# EAGLE design Dashboard buzzer tester (EAGLE 9.6.2)
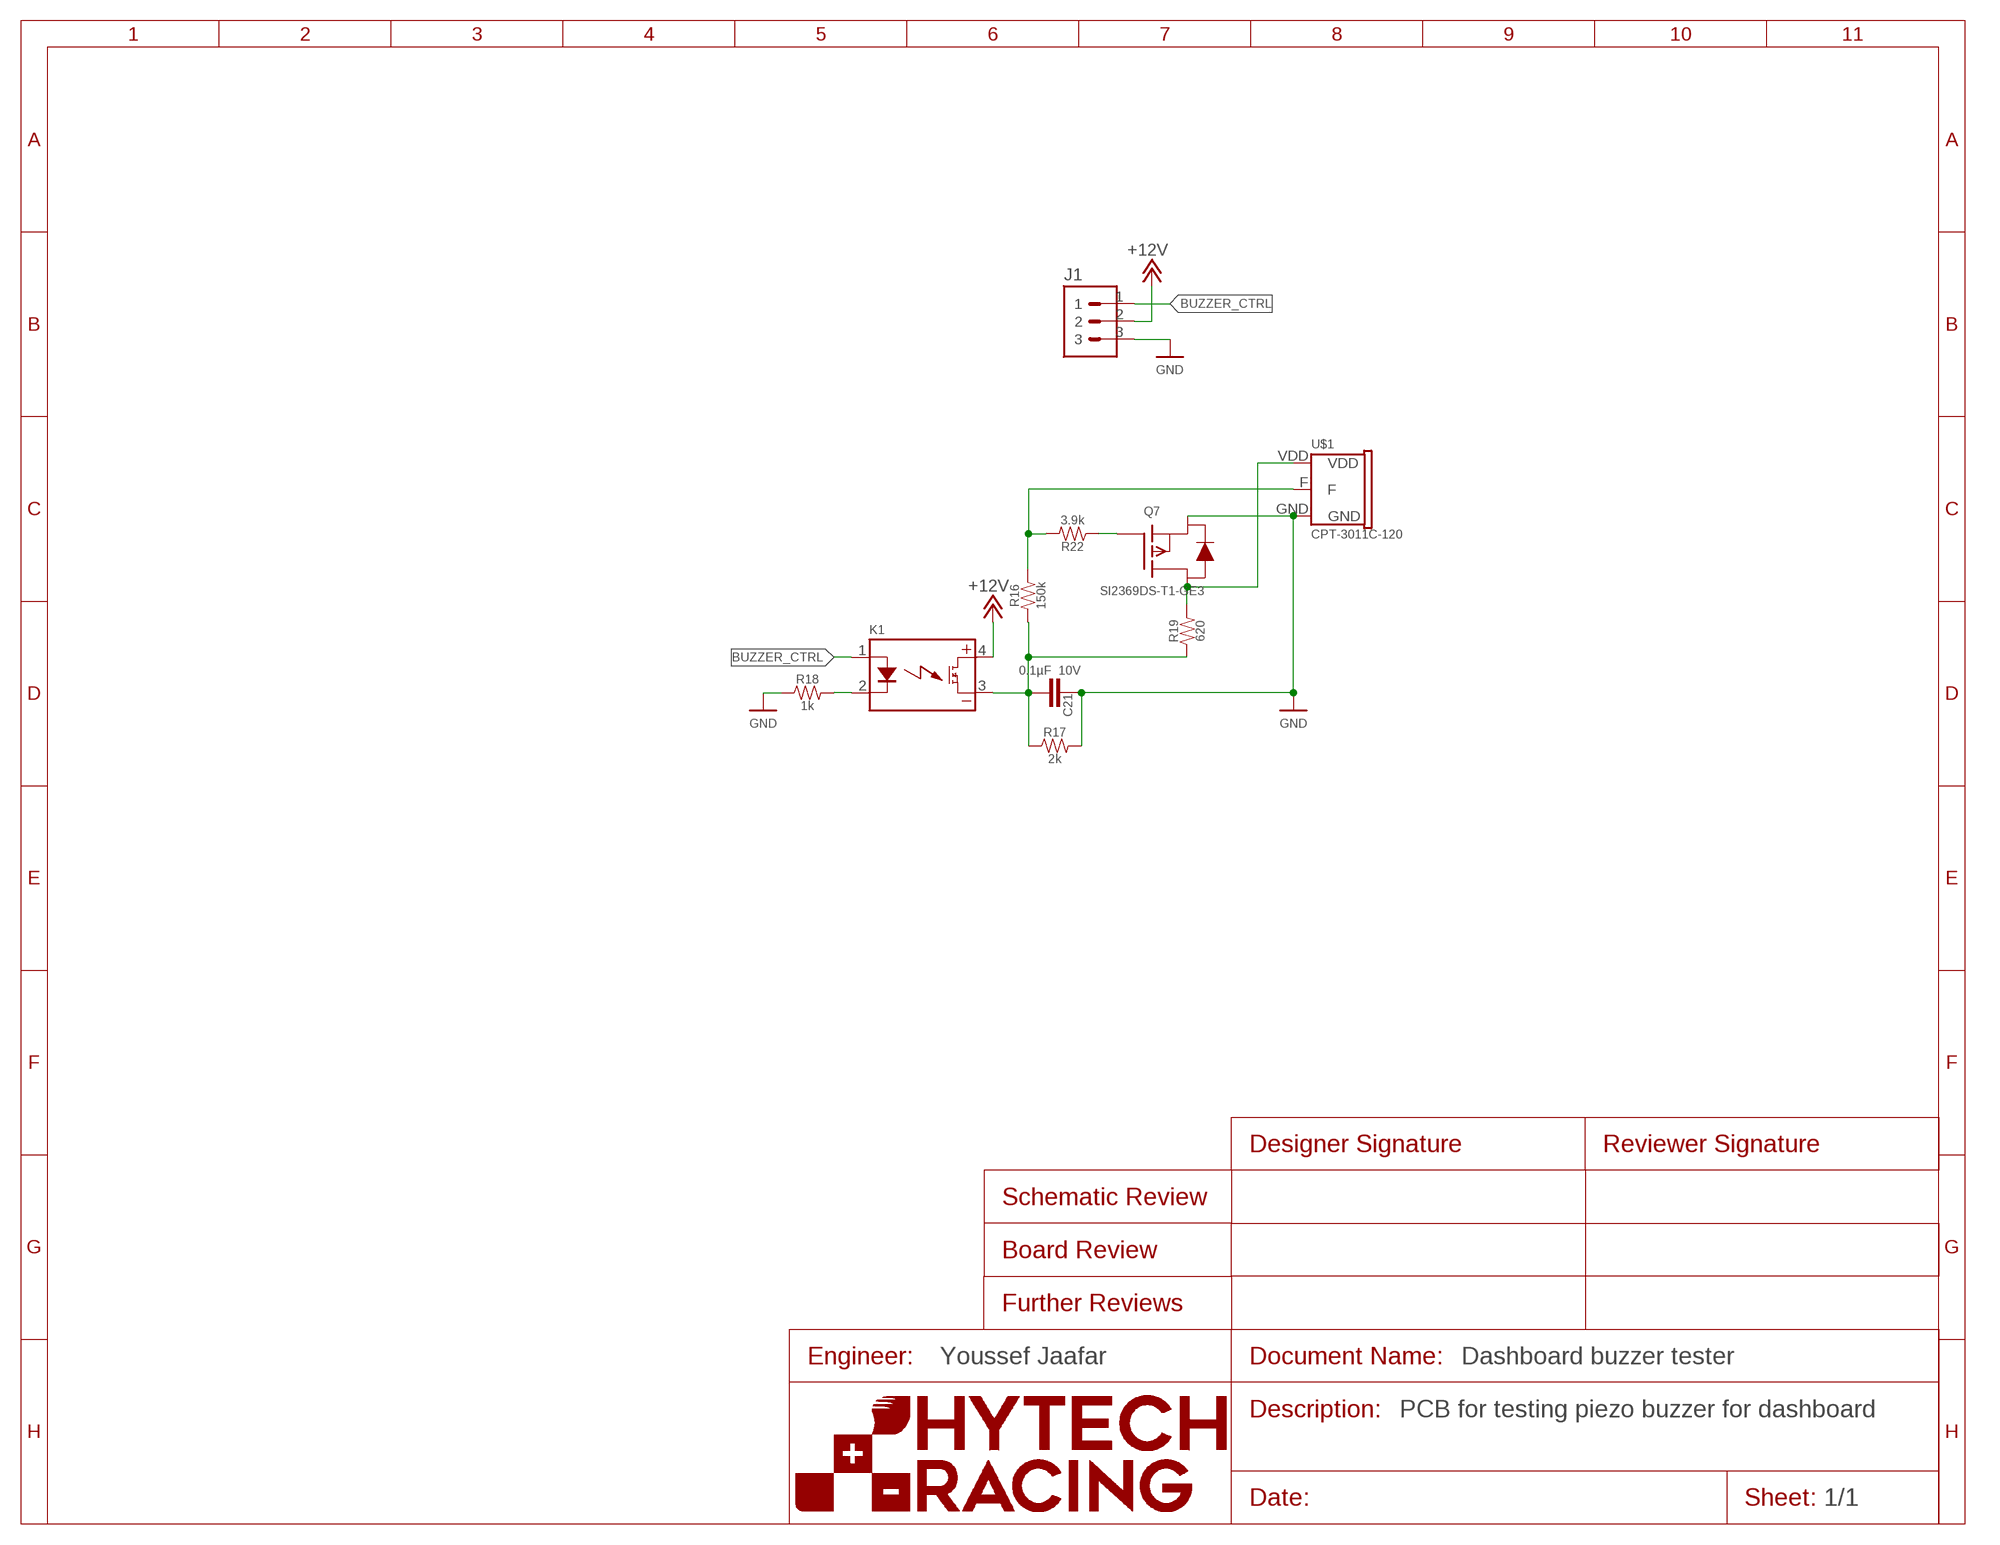
[diagram p0: schematic, sheet 1]

## Parts
C21  CAPACITOR_0603_10V_0.1UF  [0603-CAP]
J1  CONNECTOR-3  [1X03]
K1  CPC1002N  [SOP-04]
Q7  TRANSISTOR_P_MOS_SOT23_SI2369DS-T1-GE3  [SOT-23]
R16  RESISTOR_0603_150K  [0603-RES]
R17  RESISTOR_0603_2K  [0603-RES]
R18  RESISTOR_0603_1K  [0603-RES]
R19  RESISTOR_0603_620  [0603-RES]
R22  RESISTOR_0603_3.9K  [0603-RES]
U$1  BUZZER_3_PIN_CPT-3011C-120  [CPT-3011C-120]

## Nets
+12V: J1.2 K1.4(DC+)
BUZZER_CTRL: J1.1 K1.1(CONTROL+)
BUZZER_OUT: C21.1 K1.3(DC-) R16.1 R17.1 R19.1
GND: C21.2 J1.3 Q7.2(S) R17.2 R18.1 U$1.GND
N$2: Q7.3(D) R19.2 U$1.VDD
N$3: Q7.1(G) R22.1
N$4: R16.2 R22.2 U$1.F
N$68: K1.2(CONTROL-) R18.2

## Notes on the sheet
- Youssef Jaafar
- PCB for testing piezo buzzer for dashboard

## Library data of the parts
C21 = HyTechDevices:CAPACITOR_?_*: Capacitor, Non-Polarized VJ...1BC Series Datasheet <https://www.mouser.com/datasheet/2/427/vjw1bcbascomseries-1762447.pdf> Samsung Datasheet <https://www.mouser.com/datasheet/2/585/MLCC-1837944.pdf> Walsin Datasheet <https://www.mouser.com/datasheet/2/210/WTC_MLCC_General_Purpose-1534899.pdf> GRM188R61A226ME15D <https://www.mouser.com/datasheet/2/281/1/GRM188R61A226ME15_02A-1985787.pdf> GRM188R61E106MA73D <https://www.mouser.com/datasheet/2/281/1/GRM188R61E106MA73_01A-1985806.pdf> 885012006013 <https://www.mouser.com/datasheet/2/445/885012006013-1726946.pdf> 2220Y6300105KXTWS2 <https://www.mouser.com/datasheet/2/218/SMD_High_and_Std_StackiCap_P62-1825512.pdf> Yageo Class 2, X5R <https://www.mouser.com/datasheet/2/447/UPY_GPHC_X5R_4V_to_50V_26-1827097.pdf> TDK C Series <https://www.mouser.com/ProductDetail/TDK/C3216X5R1V226M160AC?qs=%2Fha2pyFadujbcx9jh7lYl%2F4NeMoXFhdc8AqVWNq4wW6M2y7zl6GzBuhgtI0ngznN>; CAPACITANCE: 0.1µF; DKPN: 720-1688-1-ND; MANUFACTURER: Vishay Vitramon; MOPN: 77-VJ0603Y104JXQPBC; MPN: VJ0603Y104JXQPW1BC; TOLERANCE: 5%; VOLTAGE: 10V
J1 = HyTechDevices - Copy:CONNECTOR-3: 3 Pin Connector
K1 = HyTechDevices - Copy:CPC1002N: IXYS Solid State Relay .7A
Q7 = HyTechDevices:TRANSISTOR_P_MOS_?_*: MOSFET P Channel Datasheet <https://www.mouser.com/datasheet/2/427/si2369d-1764360.pdf>; DKPN: SI2369DS-T1-GE3CT-ND; MANUFACTURER: Vishay Siliconix; MOPN: 78-SI2369DS-T1-GE3; MPN: SI2369DS-T1-GE3
R16 = HyTechDevices:RESISTOR_?_*: Resistor PWR163 Series <https://www.mouser.com/datasheet/2/54/pwr163-777985.pdf> AC Series <https://www.mouser.com/datasheet/2/447/Yageo_PYu_AC_51_RoHS_L_7_1714230-1874691.pdf> PU Series <https://www.mouser.com/datasheet/2/447/PYu-PU_51_RoHS_L_6-1504619.pdf> ERA Series <https://www.mouser.com/datasheet/2/315/AOA0000C307-1149632.pdf> PWR263 Series <https://www.mouser.com/datasheet/2/54/pwr263s_35-778069.pdf> RC Series <https://www.mouser.com/datasheet/2/447/Yageo_03_18_2021_PYu_RC_Group_51_RoHS_L_11-2199992.pdf> ERJ Series <https://www.mouser.com/datasheet/2/315/AOA0000C328-1530132.pdf>; DKPN: P150KDBCT-ND; MANUFACTURER: Panasonic Electronic Components; MOPN: 667-ERA-3AEB154V; MPN: ERA-3AEB154V; POWER: 0.1W; RESISTANCE: 150k; TOLERANCE: 0.1%; VOLTAGE_CONTINUOUS: 75V; VOLTAGE_MAX: 75V
R17 = HyTechDevices:RESISTOR_?_*: Resistor PWR163 Series <https://www.mouser.com/datasheet/2/54/pwr163-777985.pdf> AC Series <https://www.mouser.com/datasheet/2/447/Yageo_PYu_AC_51_RoHS_L_7_1714230-1874691.pdf> PU Series <https://www.mouser.com/datasheet/2/447/PYu-PU_51_RoHS_L_6-1504619.pdf> ERA Series <https://www.mouser.com/datasheet/2/315/AOA0000C307-1149632.pdf> PWR263 Series <https://www.mouser.com/datasheet/2/54/pwr263s_35-778069.pdf> RC Series <https://www.mouser.com/datasheet/2/447/Yageo_03_18_2021_PYu_RC_Group_51_RoHS_L_11-2199992.pdf> ERJ Series <https://www.mouser.com/datasheet/2/315/AOA0000C328-1530132.pdf>; DKPN: P2.0KBDCT-ND; MANUFACTURER: Panasonic Electronic Components; MOPN: 667-ERA-3ARB202V; MPN: ERA-3ARB202V; POWER: 0.1W; RESISTANCE: 2k; TOLERANCE: 0.1%; VOLTAGE_CONTINUOUS: 14.14V; VOLTAGE_MAX: 75V
R18 = HyTechDevices:RESISTOR_?_*: Resistor PWR163 Series <https://www.mouser.com/datasheet/2/54/pwr163-777985.pdf> AC Series <https://www.mouser.com/datasheet/2/447/Yageo_PYu_AC_51_RoHS_L_7_1714230-1874691.pdf> PU Series <https://www.mouser.com/datasheet/2/447/PYu-PU_51_RoHS_L_6-1504619.pdf> ERA Series <https://www.mouser.com/datasheet/2/315/AOA0000C307-1149632.pdf> PWR263 Series <https://www.mouser.com/datasheet/2/54/pwr263s_35-778069.pdf> RC Series <https://www.mouser.com/datasheet/2/447/Yageo_03_18_2021_PYu_RC_Group_51_RoHS_L_11-2199992.pdf> ERJ Series <https://www.mouser.com/datasheet/2/315/AOA0000C328-1530132.pdf>; DKPN: 311-1.00KHRCT-ND; MANUFACTURER: Yageo; MOPN: 603-RC0603FR-071KL; MPN: RC0603FR-071KL; POWER: 0.1W; RESISTANCE: 1k; TOLERANCE: 1%; VOLTAGE_CONTINUOUS: 10.00V; VOLTAGE_MAX: 75V
R19 = HyTechDevices:RESISTOR_?_*: Resistor PWR163 Series <https://www.mouser.com/datasheet/2/54/pwr163-777985.pdf> AC Series <https://www.mouser.com/datasheet/2/447/Yageo_PYu_AC_51_RoHS_L_7_1714230-1874691.pdf> PU Series <https://www.mouser.com/datasheet/2/447/PYu-PU_51_RoHS_L_6-1504619.pdf> ERA Series <https://www.mouser.com/datasheet/2/315/AOA0000C307-1149632.pdf> PWR263 Series <https://www.mouser.com/datasheet/2/54/pwr263s_35-778069.pdf> RC Series <https://www.mouser.com/datasheet/2/447/Yageo_03_18_2021_PYu_RC_Group_51_RoHS_L_11-2199992.pdf> ERJ Series <https://www.mouser.com/datasheet/2/315/AOA0000C328-1530132.pdf>; DKPN: 311-620HRCT-ND; MANUFACTURER: Yageo; MOPN: 603-RC0603FR-07620RL; MPN: RC0603FR-07620RL; POWER: 0.1W; RESISTANCE: 620; TOLERANCE: 1%; VOLTAGE_CONTINUOUS: 7.87V; VOLTAGE_MAX: 75V
R22 = HyTechDevices:RESISTOR_?_*: Resistor PWR163 Series <https://www.mouser.com/datasheet/2/54/pwr163-777985.pdf> AC Series <https://www.mouser.com/datasheet/2/447/Yageo_PYu_AC_51_RoHS_L_7_1714230-1874691.pdf> PU Series <https://www.mouser.com/datasheet/2/447/PYu-PU_51_RoHS_L_6-1504619.pdf> ERA Series <https://www.mouser.com/datasheet/2/315/AOA0000C307-1149632.pdf> PWR263 Series <https://www.mouser.com/datasheet/2/54/pwr263s_35-778069.pdf> RC Series <https://www.mouser.com/datasheet/2/447/Yageo_03_18_2021_PYu_RC_Group_51_RoHS_L_11-2199992.pdf> ERJ Series <https://www.mouser.com/datasheet/2/315/AOA0000C328-1530132.pdf>; DKPN: 311-3.90KHRCT-ND; MANUFACTURER: Yageo; MOPN: 603-RC0603FR-073K9L; MPN: RC0603FR-073K9L; POWER: 0.1W; RESISTANCE: 3.9k; TOLERANCE: 1%; VOLTAGE_CONTINUOUS: 19.75V; VOLTAGE_MAX: 75V
U$1 = HyTechDevices:BUZZER_3_PIN_: CPT-3011C-120 Datasheet <https://www.cuidevices.com/product/resource/cpt-3011c-120.pdf>; DPN: 102-3762-ND; FREQUENCY: 3kHz; MANUFACTURER: CUI Devices; MOPN: 490-CPT-3011C-120; MPN: CPT-3011C-120; VOLTAGE: 12V; VOLUME: 85dB

## Board
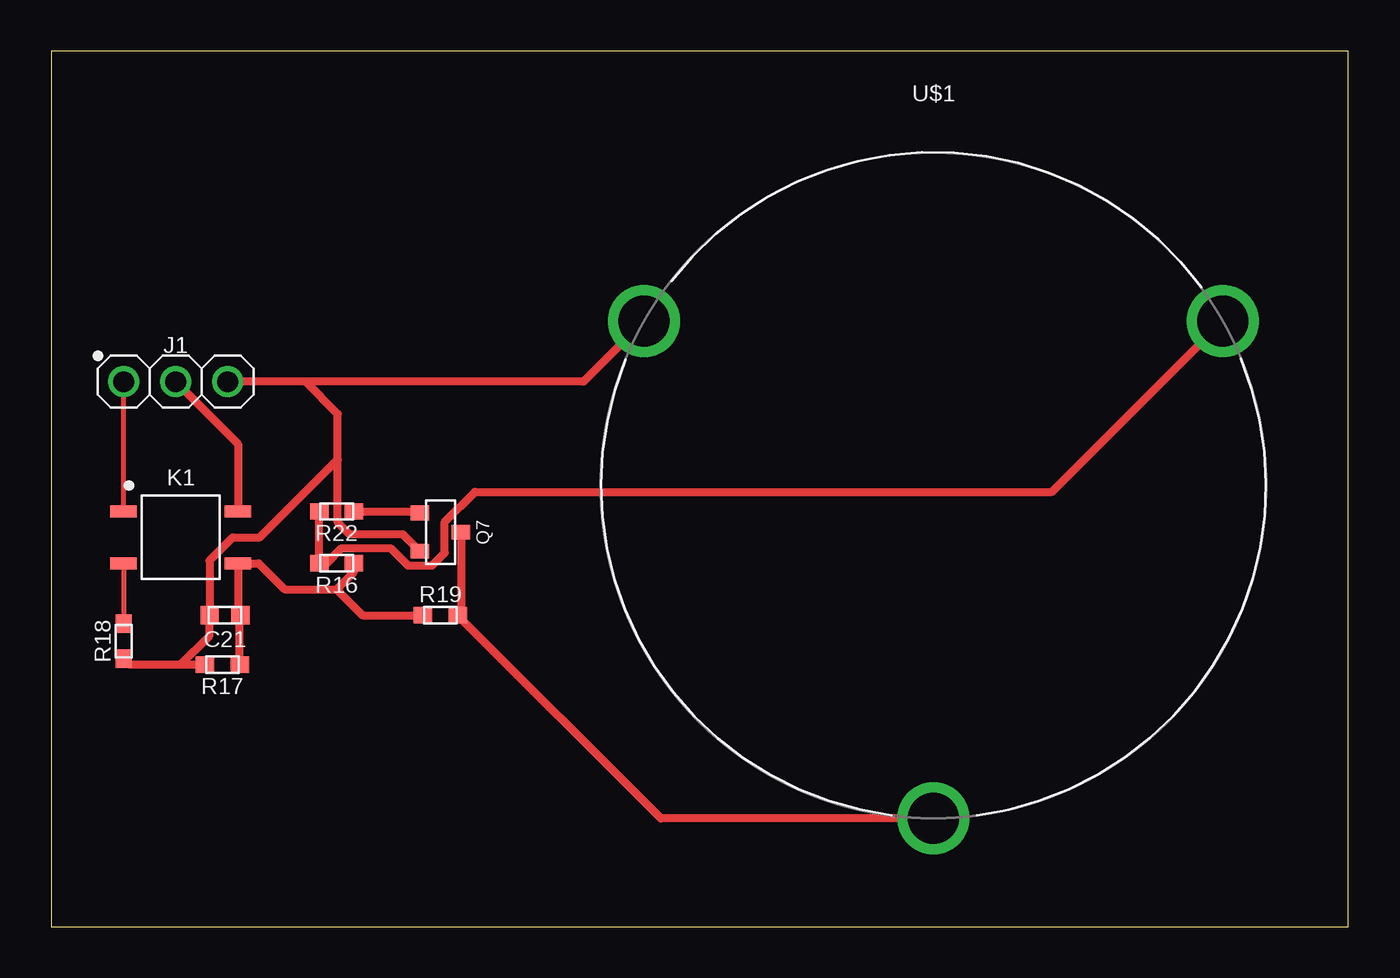
[diagram p1: board, top side]

Size 63.48 x 42.85 mm. Coordinates in mm from the lower left corner, seen from the top.
Outline: 0,0 63.48,0 63.48,42.85 0,42.85 0,0
Copper layers (1*16): Top 0.035mm / dielectric 1.5mm / Bottom 0.035mm
Design rules "default": minimum track width 6mil, minimum drill 0.35mm, track to track 6mil, track to pad 6mil, pad to pad 6mil, via to via 6mil, smd to smd 6mil, copper to edge 40mil, drill to drill 6mil, minimum pad ring 10mil, minimum via ring 8mil, stop-mask expansion 4mil, vias tented up to drill 0mil, thermal gap 10mil

### Footprints (pad centres in the part's own frame; a part is rotated, then mirrored left to right if it is on the bottom)
0603-CAP = smd 0.9 x 0.9: 1 -0.75,0; 2 0.75,0
1X03 = drill 1.016: 1 -2.54,0; 2 0,0; 3 2.54,0
SOP-04 = smd 0.6 x 1.3: 1 -1.27,-2.8; 2 1.27,-2.8; 3 1.27,2.8; 4 -1.27,2.8
SOT-23 = smd 0.711 x 0.889: 1 -0.94,-1.003; 2 0.94,-1.003; 3 0,1.003
0603-RES = smd 0.9 x 0.8: 1 -0.85,0; 2 0.85,0
CPT-3011C-120 = drill 2.5: F 14.162,8.051; GND -14.162,8.051; VDD 0,-16.29

### Placement (x,y rotation side)
C21  8.51,15.24 180 top
J1  6.1,26.67 0 top
K1  6.35,19.05 270 top
Q7  19.05,19.3 270 top
R16  13.97,17.78 180 top
R17  8.38,12.83 180 top
R18  3.56,13.97 90 top
R19  19.05,15.24 0 top
R22  13.97,20.32 180 top
U$1  43.18,21.59 0 top

### Tracks (layer width: path | path; a pad name or v marks a point on that pad's centre or on a via)
+12V
  Top 0.381: J1.2 9.15,23.62 K1.4
BUZZER_CTRL
  Top 0.254: K1.1 J1.1
BUZZER_OUT
  Top 0.381: 9.23,15.21 C21.1 | 9.23,15.21 9.15,15.29 K1.3 10.16,17.78 11.43,16.51 13.97,16.51 | R17.1 9.23,15.21 | 13.97,16.51 14.82,17.36 R16.1 | 13.97,16.51 15.24,15.24 R19.1
GND
  Top 0.381: 12.45,26.67 26.05,26.67 U$1.GND | 12.45,26.67 J1.3 | 12.45,26.67 14.03,25.09 14.03,22.86 | 14.03,22.86 14.03,19.78 14.61,19.2 17.21,19.2 Q7.2 | 14.03,22.86 10.22,19.05 8.89,19.05 7.76,17.92 C21.2 7.76,14.24 6.35,12.83 | R18.1 3.85,12.83 6.35,12.83 | 6.35,12.83 R17.2
N$2
  Top 0.254: 20.05,15.39 R19.2
  Top 0.381: U$1.VDD 29.84,5.3 R19.2 | Q7.3 20.05,15.39
N$3
  Top 0.381: R22.1 17.97,20.32 Q7.1
N$4
  Top 0.381: R22.2 R16.2 13.48,17.78 14.23,18.52 16.6,18.52 17.46,17.67 18.63,17.67 19.27,18.3 19.27,19.8 20.74,21.27 48.97,21.27 U$1.F
N$68
  Top 0.254: K1.2 R18.2